# Altium project Esp8266_SMD.PrjPcb
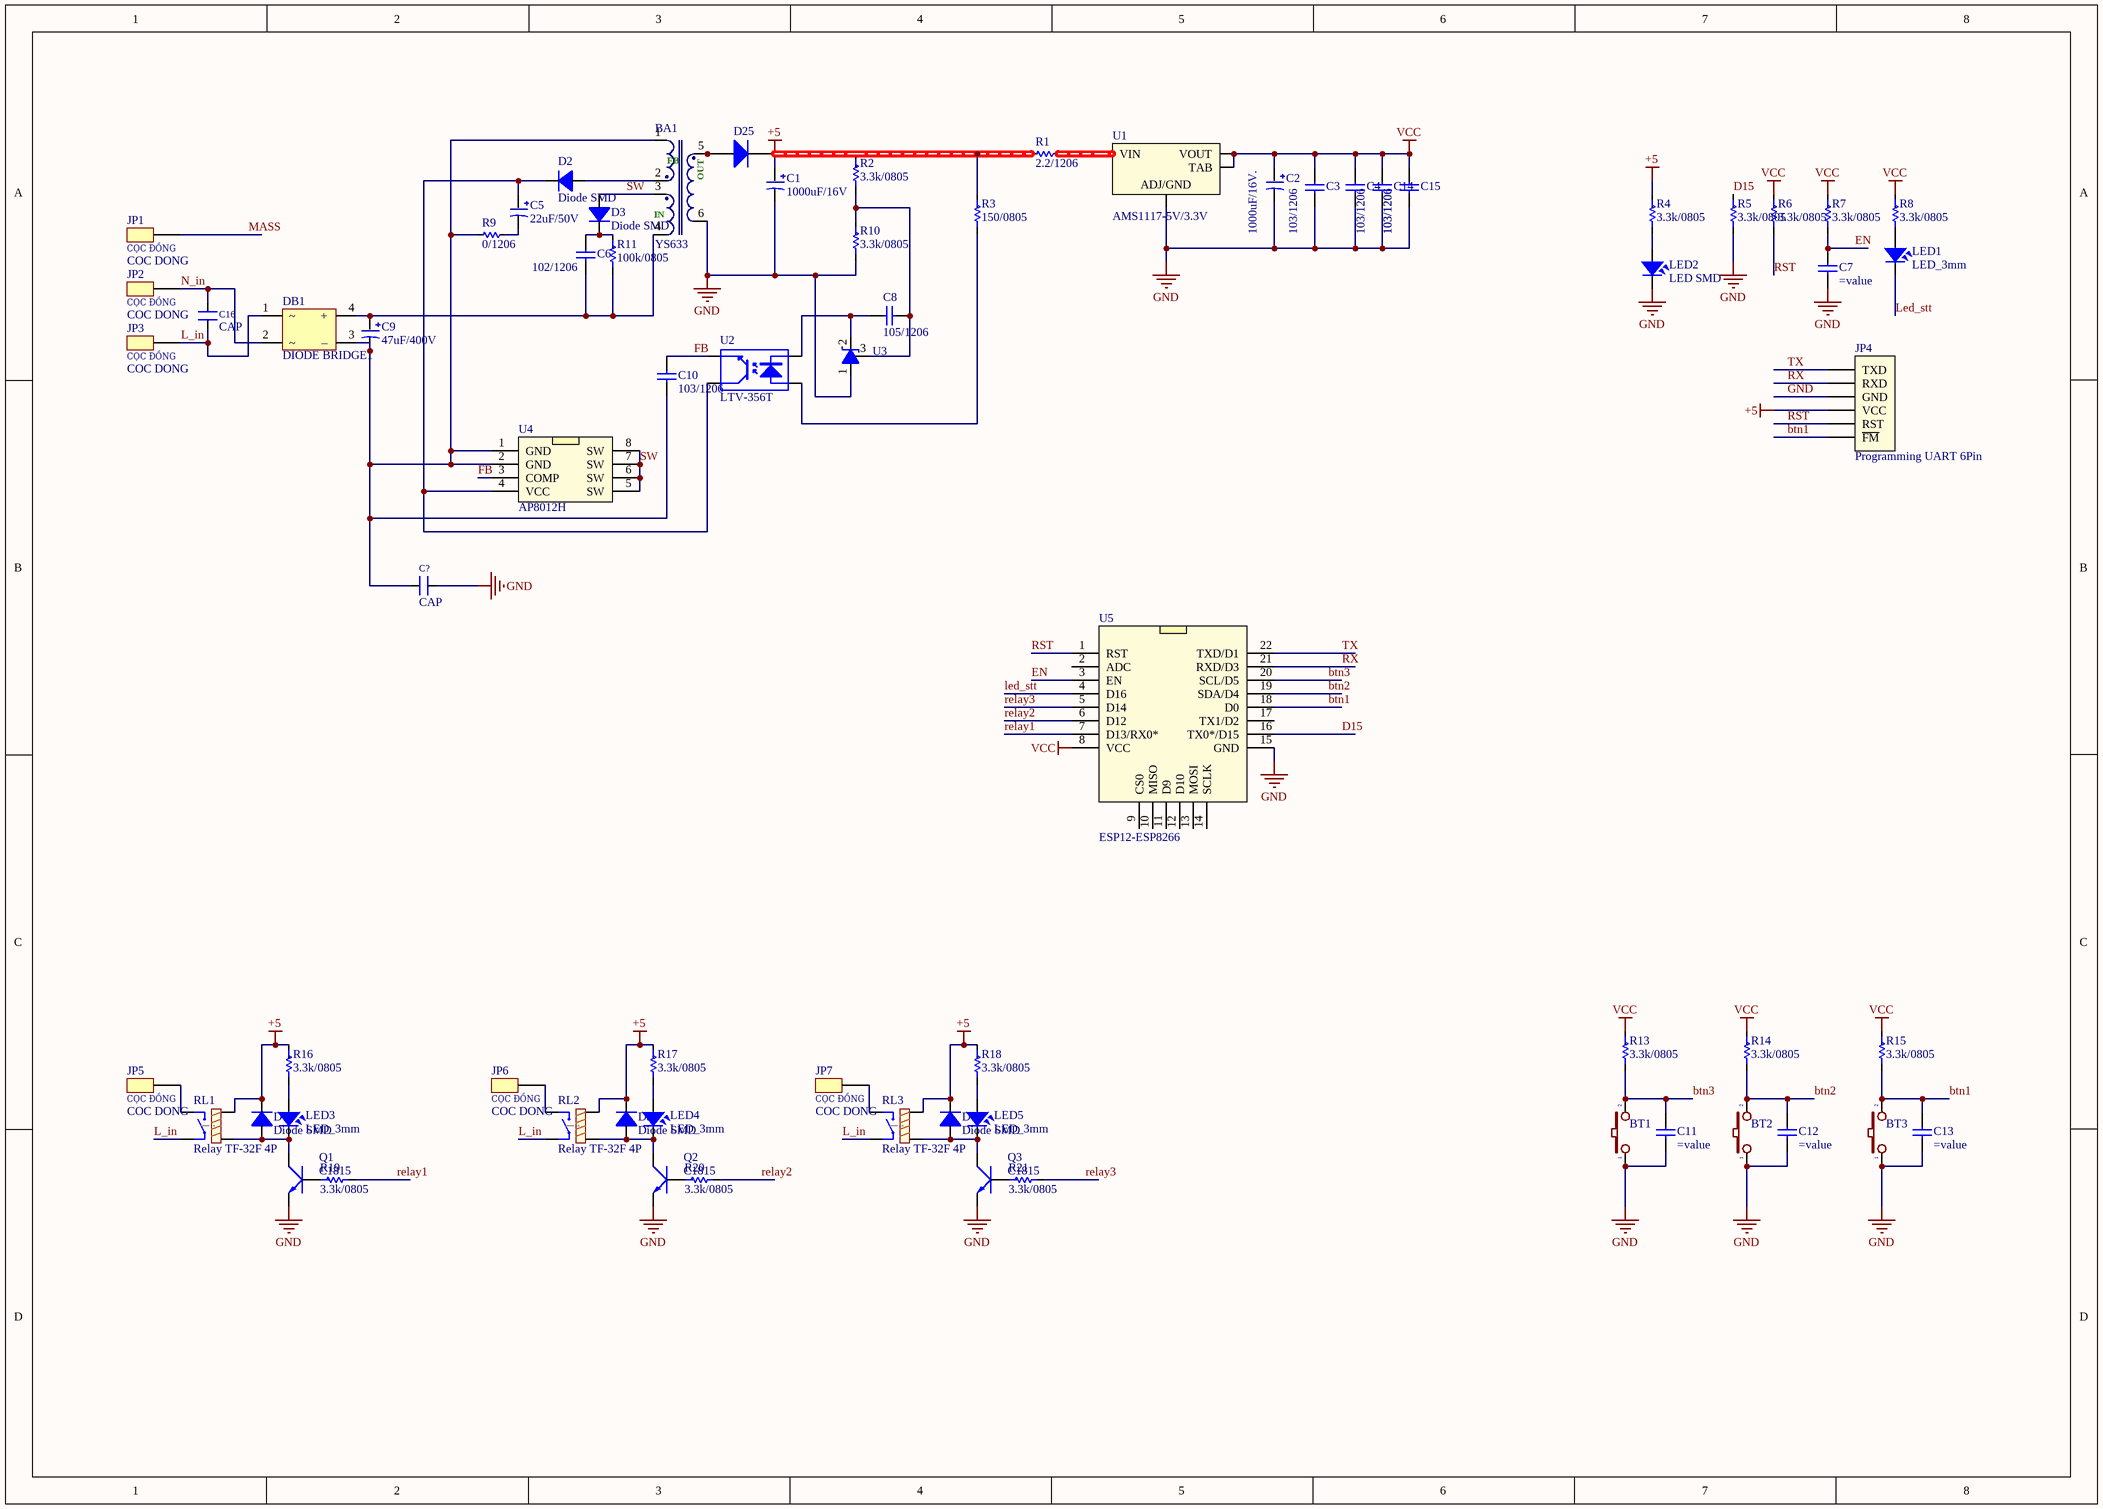
[diagram p0: Sheet1.SchDoc]
1 sheet, 71 parts. Net scope: global (net labels, ports and power ports of the same name join across sheets).
Board file: PCB1.PcbDoc

## Sheet Sheet1.SchDoc
size A3

### Parts
BA1  YS633  [Transformers]
BT1  BUTTON1  [SW4_SMD]  (value not drawn)
BT2  BUTTON1  [SW4_SMD]  (value not drawn)
BT3  BUTTON1  [SW4_SMD]  (value not drawn)
C1  1000uF/16V  [CA-ALU-8]
C2  1000uF/16V.  [CA-ALU-2.54]
C3  103/1206  [SM-Cap-1206]
C4  103/1206  [SM-Cap-1206]
C5  22uF/50V  [CA-ALU-2.54]
C6  102/1206  [SM-Cap-1206]
C7  (no value)  [SM-CAP-0805]
C8  105/1206  [SM-Cap-1206]
C9  47uF/400V  [CA-ALU-8]
C10  103/1206  [SM-Cap-1206]
C11  (no value)  [SM-CAP-0805]
C12  (no value)  [SM-CAP-0805]
C13  (no value)  [SM-CAP-0805]
C14  103/1206  [SM-Cap-1206]
C15  103/1206  [SM-Cap-1206]
C16  CAP  [CAP-5.08]
C?  CAP  [CAP-5.08]
D2  Diode SMD  [SOD-323]
D3  Diode SMD  [SOD-123]
D4  Diode SMD  [SOD-123]
D5  Diode SMD  [SOD-123]
D6  Diode SMD  [SOD-123]
D25  Diode  [D5AN]  (value not drawn)
DB1  DIODE BRIDGE1  [DB-MBS]
JP1  COC DONG  [COC-DONG]
JP2  COC DONG  [COC-DONG]
JP3  COC DONG  [COC-DONG]
JP4  Programming UART 6Pin  [JP6 2.54 No3D]
JP5  COC DONG  [COC-DONG]
JP6  COC DONG  [COC-DONG]
JP7  COC DONG  [COC-DONG]
LED1  LED_3mm  [LED-3]
LED2  LED SMD  [LED-0805-Green]
LED3  LED_3mm  [LED-3]
LED4  LED_3mm  [LED-3]
LED5  LED_3mm  [LED-3]
Q1  C1815  [SOT23B]
Q2  C1815  [SOT23B]
Q3  C1815  [SOT23B]
R1  2.2/1206  [RES-SMD-1206]
R2  3.3k/0805  [SM-RES-0805]
R3  150/0805  [SM-RES-0805]
R4  3.3k/0805  [SM-RES-0805]
R5  3.3k/0805  [SM-RES-0805]
R6  3.3k/0805  [SM-RES-0805]
R7  3.3k/0805  [SM-RES-0805]
R8  3.3k/0805  [SM-RES-0805]
R9  0/1206  [RES-SMD-1206]
R10  3.3k/0805  [SM-RES-0805]
R11  100k/0805  [SM-RES-0805]
R13  3.3k/0805  [SM-RES-0805]
R14  3.3k/0805  [SM-RES-0805]
R15  3.3k/0805  [SM-RES-0805]
R16  3.3k/0805  [SM-RES-0805]
R17  3.3k/0805  [SM-RES-0805]
R18  3.3k/0805  [SM-RES-0805]
R19  3.3k/0805  [SM-RES-0805]
R20  3.3k/0805  [SM-RES-0805]
R21  3.3k/0805  [SM-RES-0805]
RL1  Relay TF-32F 4P  [RELAY TENGFEI TF-32F 4P]
RL2  Relay TF-32F 4P  [RELAY TENGFEI TF-32F 4P]
RL3  Relay TF-32F 4P  [RELAY TENGFEI TF-32F 4P]
U1  AMS1117-5V/3.3V  [SOT-223]
U2  LTV-356T  [LTV-356T]
U3  AZ431  [SOT23-AZ431]  (value not drawn)
U4  AP8012H  [SOP-8]
U5  ESP12-ESP8266  [ESP12_type1]

### Nets
+5: C1.1 D4.2 D5.2 D6.2 D25.2(K) JP4.4(VCC) R1.2 R2.1 R3.1 R4.1 R16.1 R17.1 R18.1 RL1.1 RL2.1 RL3.1
GND: BA1.6 BT1.1 BT2.1 BT3.1 C1.2 C2.2 C3.1 C4.1 C7.1 C11.2 C12.2 C13.2 C14.1 C15.1 C?.1 JP4.3(GND) LED2.2 Q1.1(E) Q2.1(E) Q3.1(E) R5.2 R10.2 U1.1(ADJ/GND) U3.1 U5.15(GND)
VCC: C2.1 C3.2 C4.2 C14.2 C15.2 R6.1 R7.1 R8.1 R13.1 R14.1 R15.1 U1.2(VOUT) U1.4(TAB) U5.8(VCC)
btn1: BT3.2 C13.1 JP4.6(~{FM}) R15.2 U5.18(D0)
btn2: BT2.2 C12.1 R14.2 U5.19(SDA/D4)
btn3: BT1.2 C11.1 R13.2 U5.20(SCL/D5)
D15: R5.1 U5.16(TX0*/D15)
EN: C7.2 R7.2 U5.3(EN)
FB: C10.2 U2.3(E) U4.3(COMP)
L_in: C16.1 DB1.1 JP3.1 RL1.4 RL2.4 RL3.4
Led_stt: LED1.2 U5.4(D16)
MASS: JP1.1
N_in: C16.2 DB1.2 JP2.1
relay1: R19.2 U5.7(D13/RX0*)
relay2: R20.2 U5.6(D12)
relay3: R21.2 U5.5(D14)
RST: JP4.5(RST) R6.2 U5.1(RST)
RX: JP4.2(RXD) U5.21(RXD/D3)
SW: BA1.3 D3.1 U4.5(SW) U4.6(SW) U4.7(SW) U4.8(SW)
TX: JP4.1(TXD) U5.22(TXD/D1)
NetBA1_1: BA1.1 C9.2 C10.1 C?.2 DB1.3(–) R9.2 U4.1(GND) U4.2(GND)
NetBA1_2: BA1.2 D2.1
NetBA1_4: BA1.4 C6.1 C9.1 DB1.4(+) R11.2
NetBA1_5: BA1.5 D25.1(A)
NetC5_1: C5.1 D2.2 U2.4(C) U4.4(VCC)
NetC5_2: C5.2 R9.1
NetC6_2: C6.2 D3.2 R11.1
NetC8_1: C8.1 U2.2(K) U3.2
NetC8_2: C8.2 R2.2 R10.1 U3.3
NetD4_1: D4.1 LED3.2 Q1.2(C) RL1.2
NetD5_1: D5.1 LED4.2 Q2.2(C) RL2.2
NetD6_1: D6.1 LED5.2 Q3.2(C) RL3.2
NetJP5_1: JP5.1 RL1.5
NetJP6_1: JP6.1 RL2.5
NetJP7_1: JP7.1 RL3.5
NetLED1_1: LED1.1 R8.2
NetLED2_1: LED2.1 R4.2
NetLED3_1: LED3.1 R16.2
NetLED4_1: LED4.1 R17.2
NetLED5_1: LED5.1 R18.2
NetQ1_3: Q1.3(B) R19.1
NetQ2_3: Q2.3(B) R20.1
NetQ3_3: Q3.3(B) R21.1
NetR1_1: R1.1 U1.3(VIN)
NetR3_2: R3.2 U2.1(A)

Not connected (* = marked no-connect by the designer): U5 2(ADC) 9(CS0) 10(MISO) 11(D9) 12(D10) 13(MOSI) 14(SCLK) 17(TX1/D2)

### Notes on the sheet
- (in symbol BA_YS633) FB; OUT; IN
- (in symbol JP1) CỌC ĐỒNG

### Library data of the parts
BA1 = BA_YS633: Bien ap xung YS633
BT1-BT3 = BUTTON1: Value: 1N4007
C1 C2 C5 C9 = CAP-ALU-DIP: Capacitor (Semiconductor SIM Model); Value: 104; LatestRevisionDate: 17-Jul-2002; LatestRevisionNote: Re-released for DXP Platform.; PackageReference: C1206; Publisher: Altium Limited
C3 C4 C6-C8 C10-C15 = Capacitor SMD: Capacitor SMD 0402 - 1206
C16 C? = CAP: Value: 0,1uF/300V; Designed by: VanDungEvn
D2-D6 = Diode_SMD
D25 = Diode: Default Diode; Code - JEDEC: DO-214-AB; Value: 1N5007; Published: 8-Jun-2000; Revision: July-2002: Re-released for DXP Platform.; Publisher: Altium Limited
JP1-JP3 JP5-JP7 = JP1
JP4 = Programming UART 6Pin: Programming SWD
Q1-Q3 = C1815: NPN 600mW, ECB; pin to pad: 1>2 2>3 3>1; Value: C1815
R1 R9 = Res-SMD: Resistor; Manufacturer: Generic Components; Class: Passive; Published: 08/06/2000; Publisher: Altium Hobart Technology Centre
R2-R8 R10 R11 R13-R21 = Resistor SMD: Res SMD
RL1-RL3 = Relay TF-32F 4P: 5A 10A switching capabilities. / SPSTNO and SPDT(B-M) configurations. / Subminiature, standard PC layout. / Sealed & Unsealed types available.; ComponentLink1Description: Relay TENGFEI; ComponentLink1URL: http://www.spike-components.com/Upload/down/RELAY.pdf
U1 = AMS1117: IC on ap 5V/3.3V; ComponentLink1Description: Datasheet; ComponentLink1URL: http://www.ti.com/lit/ds/symlink/lm1117.pdf
U2 = LTV-356T: Photocuper LTV-356T
U3 = AZ431: pin to pad: 1>3 3>1; Value: 1N4007
U4 = AP8012H: The AP8012 combines a dedicated current / mode PWM controller with a high voltage power / MOSFET on the same silicon chip. / The AP8012 is available in SOP8 and DIP8 / package.; ComponentLink1Description: Datasheet; ComponentLink1URL: https://www.electrodragon.com/w/images/2/2e/AP8012.pdf
U5 = ESP12-ESP8266: ESP12